# Altium schematic sheet Buck-converter.SchDoc
size A4; SheetNumber: 5; SheetTotal: 6
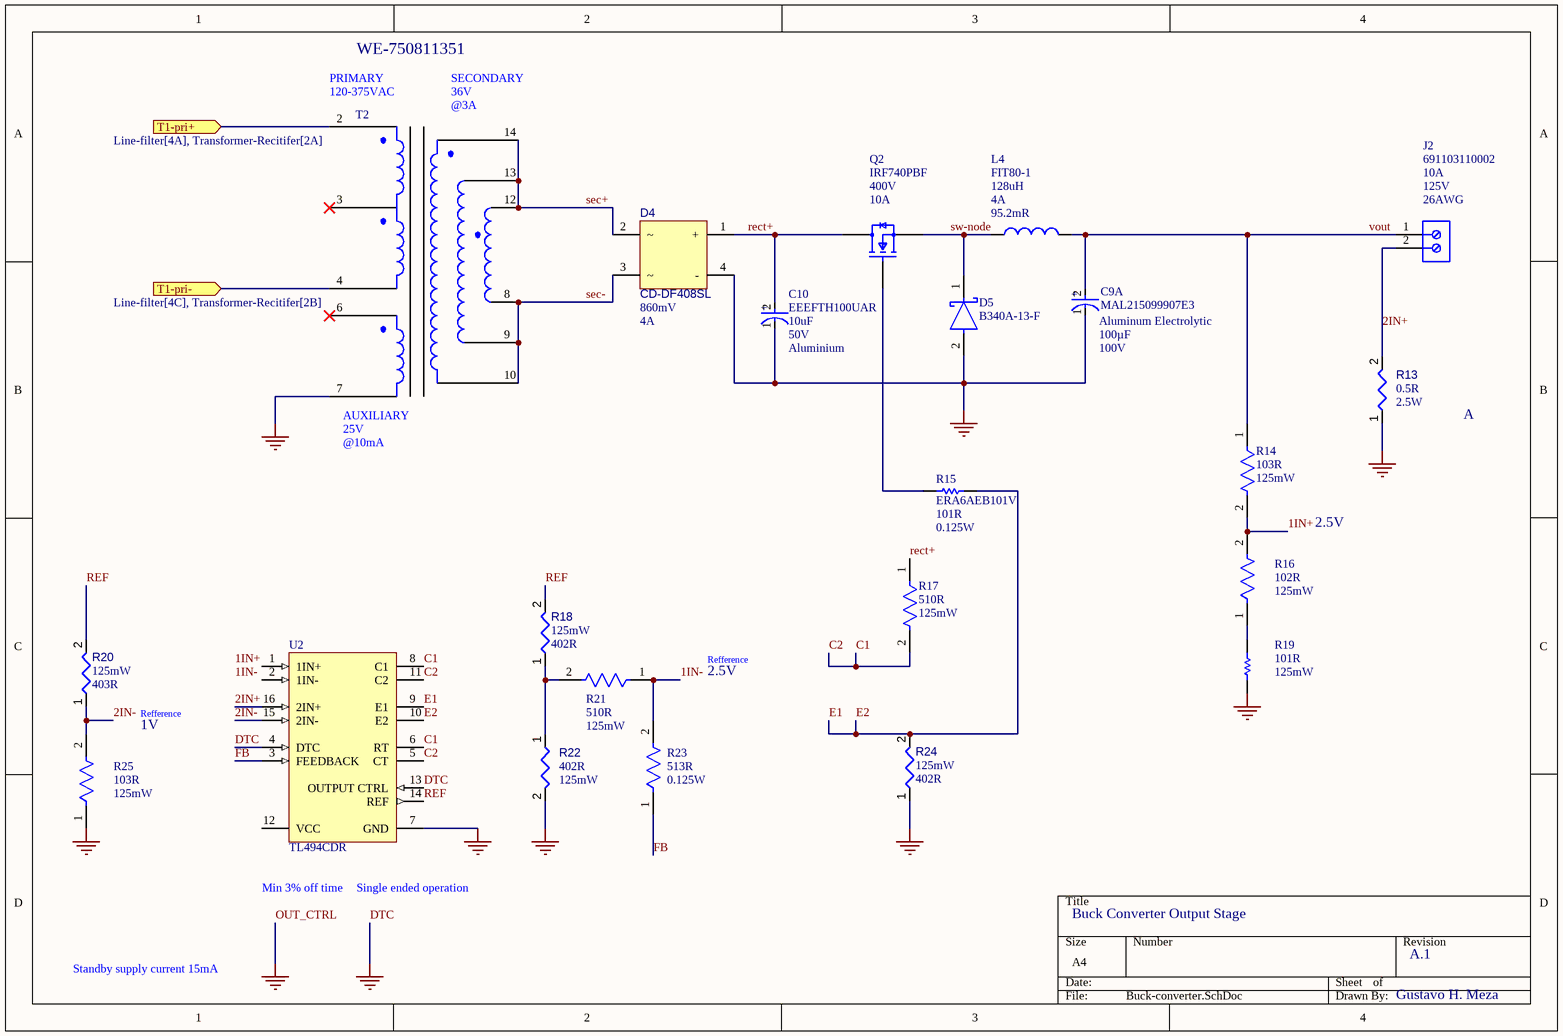
[diagram p0: Buck-converter.SchDoc]

## Parts
C9  MAL215099907E3  Voltage Rating: 100V  Capacitance: 100µF  Construction: Aluminum Electrolytic  [FP-MAL215099907E3-MFG]  (part A of 2)
C10  EEEFTH100UAR  Capacitance: 10uF  Voltage Rating: 50V  Dielectric Material: Aluminium  [FP-FTB-MFG]
D4  CD-DF408SL  Forward Voltage: 860mV  Forward Current: 4A  [CD-DF408SL-Footprint-1]
D5  B340A-13-F  [FP-SMA-MFG]
J2  691103110002  Current Rating: 10A  Voltage: 125V  Wire/Cable Gauge: 26AWG  [691103110002]
L4  FIT80-1  DC Resistance (DCR): 95.2mR  Inductance-Nom (L): 128uH  Max Current Rating: 4A  [FIT80-1-Footprint-1]
Q2  IRF740PBF  Drain To Source Voltage: 400V  Continuous Drain Current: 10A  [FP-X15-0364-MFG]
R13  value 0.5R  Power: 2.5W  [RS02CR5000FB12-Footprint-1]  (hidden comment: RS02CR5000FB12)
R14  Resistance: 103R  Power Rating: 125mW  [FP-CRCW0805-e3-IPC_A]  (hidden comment: CRCW080510K0FKEA)
R15  ERA6AEB101V  Resistance: 101R  Power rating: 0.125W  [RESC2013X60X40ML20T25]
R16  Power Rating: 125mW  Resistance: 102R  [FP-CRCW0805-e3-IPC_B]  (hidden comment: CRCW08051K00JNEA)
R17  Resistance: 510R  Power Rating: 125mW  [FP-CR0805-IPC_B]  (hidden comment: CR0805JW511E)
R18  value 402R  Power: 125mW  [RESC3416X05N]  (hidden comment: CRCW08054K00FKTA)
R19  Resistancemeter 1: 101R  Power: 125mW  [RESC2013X60X40ML20T25]  (hidden comment: ERA6AEB101V)
R20  value 403R  Power: 125mW  [RESC3416X05N]  (hidden comment: CRCW08054K00FKTA)
R21  Resistance: 510R  Power Rating: 125mW  [FP-CR0805-IPC_B]  (hidden comment: CR0805JW511E)
R22  value 402R  Power: 125mW  [RESC3416X05N]  (hidden comment: CRCW08054K00FKTA)
R23  value 513R  Power Rating: 0.125W  [FP-RT0805-MFG]  (hidden comment: RT0805BRD0751KL)
R24  value 402R  Power: 125mW  [RESC3416X05N]  (hidden comment: CRCW08054K00FKTA)
R25  Resistance: 103R  Max Power Dissipation: 125mW  [FP-ERA6A-IPC_C]  (hidden comment: ERA6AEB102V)
T2  WE-750811351  [WE-750811248-Footprint-1]
U2  TL494CDR  [D0016A_N]

## Ports
T1-pri+ (in, see Line-filter[4A], Transformer-Recitifer[2A]), T1-pri- (in, see Line-filter[4C], Transformer-Recitifer[2B])

## Nets
DTC: C9.1(C) C10.1(C) D4.4(-) D5.2(A) R13.1 R19.1 R22.2 R24.1 R25.1 T2.7 U2.4(DTC) U2.7(GND) U2.13(OUTPUT_CTRL)  [also labelled GND, OUT_CTRL]
1IN+: R14.2 R16.2
1IN-: R21.1 R23.2
2IN+: J2.2 R13.2 U2.16(2IN+)
2IN-: R20.1 R25.2 U2.15(2IN-)
C1: R17.2 U2.5(CT) U2.6(RT) U2.8(C1) U2.11(C2)  [also labelled C2]
E1: R15.1 R24.2 U2.9(E1) U2.10(E2)  [also labelled E2]
FB: R23.1 U2.3(FEEDBACK)
rect+: C10.2(A) D4.1(+) Q2.2(D) R17.1
REF: R18.2 R20.2 U2.14(REF)
sec+: D4.2 T2.12 T2.13 T2.14
sec-: D4.3 T2.8 T2.9 T2.10
sw-node: D5.1(C) L4.1 Q2.3(S)
T1-pri+: T2.2 ; port T1-pri+
T1-pri-: T2.4 ; port T1-pri-
vout: C9.2(A) J2.1 L4.2 R14.1
NetQ2_1: Q2.1(G) R15.2
NetR16_1: R16.1 R19.2
NetR18_1: R18.1 R21.2 R22.1

Not connected (* = marked no-connect by the designer): T2 1 3 6*; U2 1(1IN+) 2(1IN-) 12(VCC)

## Notes on the sheet
- (near T2) 120-375VAC
- (near T2) PRIMARY
- (near T2) 36V
- (near T2) @3A
- (near T2) SECONDARY
- (near T2) 25V
- (near T2) @10mA
- (near T2) AUXILIARY
- A
- 2.5V
- Refference
- 1V
- Min 3% off time
- Single ended operation
- Buck Converter Output Stage
- Standby supply current 15mA
- A.1
- Gustavo H. Meza
- Labels drawn without touching a wire or pin: 1IN+, 1IN-
- (in symbol CMP-00030-68114016-1, part A) +
- (in symbol CMP-05427-000035-1) +

## Library data of the parts
C9 = CMP-00030-68114016-1: MAL215099907E3 Cap Aluminum 100uF 100V 20% (12.5 X 13mm) Cylindrical 660mA 5000 hr 105°C Blister T/R; Dissipation Factor: 10%; Polarity: Polar; Life (Hours): 3000hours; Leakage Current: 100µA; Impedance: 350mΩ; Packaging: Tape & Reel (TR); NexarPartId: 68114016; Case/Package: Radial; Mount: Surface Mount; Voltage Rating (DC): 100V; Height - Seated (Max): 13.97mm; Max Operating Temperature: 105°C; Height: 14mm; RoHS: Compliant; Tolerance: 20%; Ripple Current: 660mA; Min Operating Temperature: -40°C
C10 = CMP-05427-000035-1: CAP ALUM 10UF 20% 50V SMD; Lead Diameter: 0.65mm; Ripple Current (AC): 85mA; Leakage Current: 5uA; Life (Hours): 2000Hour; ESR (Equivalent Series Resistance): 2.3R; Termination: SMD/SMT; Diameter: 4mm; Mount: Surface Mount; Lead Pitch: 1mm; Length: 5.8mm; Min Operating Temperature: -55°C; RoHS Compliant: Yes; Package Quantity: 1; Voltage: 50V; Lead Free: Lead Free; Tolerance: 20%; Contact Plating: Tin; Ripple Current: 85mA; Radiation Hardening: No; Max Operating Temperature: 105°C; Series: FT; Voltage Rating (DC): 50V; Number of Pins: 2; Case/Package: Radial; Construction: Cylindrical; Height - Seated (Max): 0.24inch; Packaging: Tape and Reel; Height: 5.8mm
D4 = CMP-004-00034-1: Bridge Rectifier Diode, 1 Phase, 4A, 800V V(RRM), Silicon; Max Surge Current: 150A; Reach SVHC Compliant: No; Min Operating Temperature: -55°C; Max Operating Temperature: 175°C; RoHS Compliant: Yes; Mounting Technology: Flat; JESD-609 Code: e3; Diode Type: RECTIFIER
D5 = CMP-1667-00003-3: DIODE SCHOTTKY 40V 3A SMA; Max Forward Surge Current (Ifsm): 80A; Forward Voltage: 500mV; Polarity: Standard; Max Reverse Current: 500uA; Capacitance: 250pF; Element Configuration: Single; Mount: Surface Mount; Output Current: 3A; Radiation Hardening: No; Width: 2.92mm; Current Rating: 3A; Termination: SMD/SMT; Voltage: 40V; Series: -; Max Operating Temperature: 125°C; Current: 3A; Max Repetitive Reverse Voltage (Vrrm): 40V; Min Operating Temperature: -55°C; REACH SVHC: No SVHC; Number of Pins: 2; Average Rectified Current: 3A; Contact Plating: Tin; RoHS Compliant: Yes; Max Reverse Voltage (DC): 40V; Packaging: Tape and Reel; Height: 2.3mm; Length: 4.6mm; Case/Package: SMA; Weight: 0.002258oz; Peak Non-Repetitive Surge Current: 80A; Package Quantity: 5000; Lead Free: Lead Free; Forward Current: 3A; Voltage Rating (DC): 40V
J2 = CMP-1502-03254-2: NexarPartId: 18818286; Pitch: 3.5052mm; Number of Positions Per Level: 2; Plating: Steel; Number of Levels: 1; Stripping Length: -6mm; Wire Gauge (Min): 16AWG; Packaging: Box; Number of Rows: 1; Color: Blue; Height: 8.5mm; Current: 10A; Lead Pitch: 3.5mm; RoHS: Compliant; Housing Material: Nylon; Width: 8mm; Length: 7mm; Contact Plating: Tin; Number of Pins: 2; Mount: Through Hole; Min Operating Temperature: -40°C; Number of Contacts: 2; REACH SVHC: Unknown; Termination: Screw; Wire Gauge (Max): 26AWG; Max Operating Temperature: 105°C; Voltage Rating: 125V; Contact Material: Brass, Copper, Nickel, Tin, Zinc
L4 = CMP-006-00026-1: General Purpose Inductor, 128uH, 1 Element, 9863; Case/Size Code: 9863; RoHS Compliant: Yes; Pins: 2; Construction: Toroidal
Q2 = CMP-02550-000088-1: MOSFET N-CH 400V 10A TO-220AB; Manufacturer: Vishay; Power Dissipation: 125W; Turn On Delay Time: 14ns; Standoff Height: 3.33mm; Max Junction Temp: +150°C; Number Of Channels: 1; Reverse Recovery Charge: 3800nC; Turn Off Delay Time: 50ns; Threshold Vgs Min: 2V; Input Capacitace At Vds: 1400pF @ 25V; Depletion Mode: False; Gate Charge At Vgs: 63nC @ 10V; Rthja Max: 62°C/W; Threshold Vgs Max: 4V; Gate To Source Voltage: 20V; Pulse Drain Current: 40A; Reverse Recovery Time: 370ns; Drain To Source Resistance: 0.55Ω; Temperature Range Low: -55°C; Mouser Description: MOSFET N-Chan 400V 10 Amp; Package: X15-0364; RoHS: TRUE; Manufacturer Part Number: IRF740PBF; Category: Trans; Drain To Source Breakdown Voltage: 400V; Device Class L3: MOSFETs; Lead Free: Yes; Height: 19.89mm; Octopart: https://octopart.com/irf740pbf-vishay-46527100; Automotive: No; Max Forward Diode Voltage: 2V; Device Class L1: Discrete Semiconductors; ComponentLink2URL: http://www.vishay.com/docs/91054/91054.pdf; Temperature Range High: +150°C; Device Class L2: Transistors; ComponentLink2Description: Datasheet; Temperature: -55°C to +150°C; Number Of N Channels: 1; Digikey Description: MOSFET N-CH 400V 10A TO-220AB
R13 = CMP-009-00190-1: Fixed Resistor, Wire Wound, 2.5W, 0.5ohm, 1% +/-Tol, 90ppm/Cel, Through Hole Mount; Manufacturer Series: RS; Additional Feature: PRECISION; RoHS Compliant: No; Max Operating Temperature: 250°C; JESD-609 Code: e0; Pins: 2; Tolerance: 1%; Min Operating Temperature: -65°C; Mounting Technology: Through Hole
R14 = CMP-2001-04908-2: RES Thick Film, 10kΩ, 1%, 0.125W, 100ppm/°C, 0805; Voltage Rating (DC): 150V; Weight: 0.000194oz; Package Quantity: 5000; Military Standard: Not; Max Operating Temperature: 155°C; Temperature Coefficient: 100ppm/°C; Contact Plating: Tin; Width: 1.25mm; Height: 0.45mm; Radiation Hardening: No; Tolerance: 1%; Min Operating Temperature: -55°C; Voltage Rating: 150V; Length: 2mm; Depth: 1.25mm; Termination: SMD/SMT; Packaging: Tape and Reel; Case/Package: 0805; Case Code (Metric): 2012; Lead Free: Lead Free; Case Code (Imperial): 0805; Composition: Thick Film
R15 R19 = CMP-2001-00580-1: Manufacturer: Panasonic; Part Number: ERA6AEB101V
R16 = CMP-2001-03597-2: RES Thick Film, 1kΩ, 5%, 0.125W, 200ppm/°C, 0805; Voltage Rating: 150V; Depth: 1.25mm; Features: Automotive AEC-Q200; Case/Package: 0805; Lead Free: Lead Free; Width: 1.25mm; Temperature Coefficient: 200ppm/°C; Height: 0.02inch; Length: 2mm; Case Code (Metric): 2012; Mount: Surface Mount; Military Standard: Not; Contact Plating: Tin; Min Operating Temperature: -55°C; Number of Pins: 2; Weight: 0.000194oz; Case Code (Imperial): 0805; Packaging: Tape and Reel; Voltage Rating (DC): 150V; Number of Terminations: 2; Composition: Thick Film; Radiation Hardening: No; Tolerance: 5%; Package Quantity: 1; Max Power Dissipation: 125mW; Max Operating Temperature: 155°C; Termination: SMD/SMT
R17 R21 = CMP-07231-001106-1: Thick Film Chip Resistors 0805 510Ω 0.125W 5% 200ppm/°C; Voltage Rating: 150V; Case Code (Imperial): 0805; Case Code (Metric): 2012; Max Operating Temperature: 155°C; Packaging: Tape and Reel; Termination: SMD/SMT; Thickness: 508um; Min Operating Temperature: -55°C; Tolerance: 5%; Height: 0.5mm; Width: 1.25mm; Length: 2mm; Case/Package: 0805; Temperature Coefficient: 200ppm/°C; Package Quantity: 5000
R18 R20 R22 R24 = CMP-009-00184-1: RES SMD 4K OHM 1% 1/8W 0805; Manufacturer Series: CRCW; Min Operating Temperature: -55°C; Mounting Technology: Surface Mount; Case/Package: 0805; RoHS Compliant: No; Pins: 2; Tolerance: 1%; JESD-609 Code: e0; Max Operating Temperature: 155°C
R23 = CMP-03412-030464-1: RES SMD 51K OHM 0.1% 1/8W 0805; Manufacturer: Yageo; Tolerance: 0.0025; Temperature Coefficient: 25 ppm/°C; Voltage Rating: 150V; Device Class L1: Passive Components; Mouser Description: Thin Film Resistors - SMD 1/8W 51K ohm .1% 25ppm; Temperature: -55°C to +155°C; Series: RT; RoHS: TRUE; ComponentLink2Description: Datasheet; Ipc Land Pattern Name: RESC200125X50; Digikey Description: RES SMD 51K OHM 0.1% 1/8W 0805; Category: Res; Temperature Range Low: -55°C; Package: RT0805; Manufacturer Part Number: RT0805BRD0751KL; ComponentLink2URL: http://www.yageo.com/documents/recent/PYu-RT_1-to-0.01_RoHS_L_9.pdf; Device Class L3: Chip SMD Resistors; Height: 0.6mm; Octopart: https://octopart.com/rt0805brd0751kl-yageo-1414977; Resistance: 51k; Footprint Url: http://www.yageo.com/exep/pages/download/literatures/PYu-R_Mount_10.pdf; Composition: Thin Film; Device Class L2: Resistors; Lead Free: Yes; Temperature Range High: +155°C; Automotive: No
R25 = CMP-2001-00581-2: RES 1K OHM 0.1% 1/8W 0805; Temperature Coefficient: 25ppm/°C; Working Voltage: 100V; Height: 0.5mm; Technology: THIN FILM; REACH SVHC: No SVHC; Packaging: Tape and Reel; Length: 2mm; Width: 1.25mm; Resistance Tolerance: 0.1%; Series: ERA-6A; Resistor Type: Thin Film; Number of Pins: 2; Case Code (Metric): 2012; Voltage Rating: 100V; Radiation Hardening: No; Construction: Rectangular; Mount: Surface Mount; Number of Terminations: 2; Case/Package: 0805; Min Operating Temperature: -55°C; Military Standard: Not; RoHS Compliant: Yes; Termination: SMD/SMT; Case Code (Imperial): 0805; Depth: 1.25mm; Power Rating: 125mW; Max Operating Temperature: 155°C; Contact Plating: Tin; Package Quantity: 5000; Tolerance: 0.1%
T2 = CMP-012-00000-2: Power Transformers MID-L3798/99 Offline Isol 3.6uH +-10%; Power: 48W; Turns Ratio: 0.167372; Current Rating: 2A; Voltage Rating: 265V; Inductance: 300uH; Mounting Technology: THT; Max Operating Temperature: 125°C; Min Operating Temperature: -40°C; Pins: 10; RoHS Compliant: Yes
U2 = CMP-0319-00950-2: Pulse-Width-Modulation Control Circuit with Voltage Control, 45 % Duty Cycle, 0 to +70 degC, 16-pin SOIC (D), Green (RoHS & no Sb/Br); Manufacturer: Texas Instruments; Regulated Outputs(#): 2; Frequency(Max)(kHz): 300; Topology: Boost, Buck, Flyback, Forward, Full-Bridge, Half-Bridge, Push-Pull; SubFamily: PWM Controller; Duty Cycle(Max)(%): 45; Rating: Military; PackageDescription: 16-Pin Plastic Small Outline Integrated Circuit, 9.9 x 3.9 mm, Pitch 1.27 mm Pitch; Mounting Technology: Surface Mount; PackageReference: D0016A; DatasheetVersion: SLVS074E; Control Method: Voltage; ComponentLink1Description: Datasheet; ComponentLink1URL: http://www.ti.com/general/docs/lit/getliterature.tsp?genericPartNumber=TL494&fileType=pdf; Code_JEDEC: MS-012AC; Eco-Plan: Green (RoHS & no Sb/Br); PackageVersion: revM, Jun-2011; PartNumber: TL494CDR